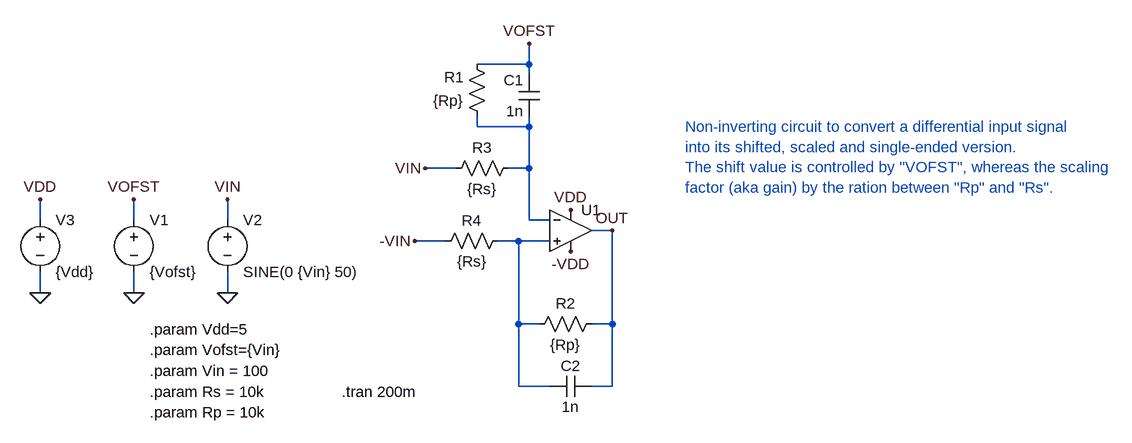
[diagram p0: schematic Signal_Scaler_2.asc]
Signal_Scaler_2.asc, the LTspice schematic file:
Version 4
SHEET 1 1568 680
WIRE 256 -96 256 -128
WIRE 256 -96 176 -96
WIRE 256 -80 256 -96
WIRE 176 0 176 -16
WIRE 256 0 256 -16
WIRE 256 0 176 0
WIRE 144 64 96 64
WIRE 256 64 256 0
WIRE 256 64 224 64
WIRE -496 144 -496 112
WIRE -352 144 -352 112
WIRE -208 144 -208 112
WIRE 256 144 256 64
WIRE 288 144 256 144
WIRE 384 160 352 160
WIRE 128 176 80 176
WIRE 240 176 208 176
WIRE 288 176 240 176
WIRE -496 256 -496 224
WIRE -352 256 -352 224
WIRE -208 256 -208 224
WIRE 240 304 240 176
WIRE 272 304 240 304
WIRE 384 304 384 160
WIRE 384 304 352 304
WIRE 240 400 240 304
WIRE 288 400 240 400
WIRE 384 400 384 304
WIRE 384 400 352 400
FLAG 384 160 OUT
FLAG -352 112 VOFST
FLAG -352 256 0
FLAG 256 -128 VOFST
FLAG -208 112 VIN
FLAG -208 256 0
FLAG 96 64 VIN
FLAG 80 176 -VIN
FLAG -496 256 0
FLAG -496 112 VDD
FLAG 320 128 VDD
FLAG 320 192 -VDD
SYMBOL cap 272 -16 R180
WINDOW 0 24 56 Left 2
WINDOW 3 24 8 Left 2
SYMATTR InstName C1
SYMATTR Value 1n
SYMBOL res 192 0 R180
WINDOW 0 36 76 Left 2
WINDOW 3 36 40 Left 2
SYMATTR InstName R1
SYMATTR Value {Rp}
SYMBOL res 256 320 R270
WINDOW 0 32 56 VTop 2
WINDOW 3 0 56 VBottom 2
SYMATTR InstName R2
SYMATTR Value {Rp}
SYMBOL res 240 48 R90
WINDOW 0 0 56 VBottom 2
WINDOW 3 32 56 VTop 2
SYMATTR InstName R3
SYMATTR Value {Rs}
SYMBOL res 224 160 R90
WINDOW 0 0 56 VBottom 2
WINDOW 3 32 56 VTop 2
SYMATTR InstName R4
SYMATTR Value {Rs}
SYMBOL cap 288 416 R270
WINDOW 0 32 32 VTop 2
WINDOW 3 0 32 VBottom 2
SYMATTR InstName C2
SYMATTR Value 1n
SYMBOL voltage -352 128 R0
WINDOW 123 0 0 Left 0
WINDOW 39 0 0 Left 0
SYMATTR InstName V1
SYMATTR Value {Vofst}
SYMBOL voltage -208 128 R0
WINDOW 123 0 0 Left 0
WINDOW 39 0 0 Left 0
SYMATTR InstName V2
SYMATTR Value SINE(0 {Vin} 50)
SYMBOL OpAmps\\UniversalOpAmp 320 160 R0
SYMATTR InstName U1
SYMBOL voltage -496 128 R0
WINDOW 123 0 0 Left 0
WINDOW 39 0 0 Left 0
SYMATTR InstName V3
SYMATTR Value {Vdd}
TEXT -32 408 Left 2 !.tran 200m
TEXT -328 312 Left 2 !.param Vdd=5
TEXT -328 408 Left 2 !.param Rs = 10k
TEXT -328 440 Left 2 !.param Rp = 10k
TEXT -328 344 Left 2 !.param Vofst={Vin}
TEXT -328 376 Left 2 !.param Vin = 100
TEXT 496 0 Left 2 ;Non-inverting circuit to convert a differential input signal\ninto its shifted, scaled and single-ended version.\nThe shift value is controlled by "VOFST", whereas the scaling\nfactor (aka gain) by the ration between "Rp" and "Rs".

The netlist it stands for:
* Signal_Scaler_2.asc
C1 N001 VOFST 1n
R1 N001 VOFST {Rp}
R2 N002 OUT {Rp}
R3 N001 VIN {Rs}
R4 N002 -VIN {Rs}
C2 N002 OUT 1n
V1 VOFST 0 {Vofst}
V2 VIN 0 SINE(0 {Vin} 50)
XU1 N002 N001 VDD -VDD OUT level1 Avol=1Meg GBW=10Meg Vos=0 En=0 Enk=0 In=0 Ink=0 Rin=500Meg  ; pins In+ In- V+ V- OUT
V3 VDD 0 {Vdd}
.tran 200m
.param Vdd=5
.param Rs = 10k
.param Rp = 10k
.param Vofst={Vin}
.param Vin = 100
* Non-inverting circuit to convert a differential input signal
* into its shifted, scaled and single-ended version.
* The shift value is controlled by "VOFST", whereas the scaling
* factor (aka gain) by the ration between "Rp" and "Rs".
.lib UniversalOpAmp1.lib
.backanno
.end